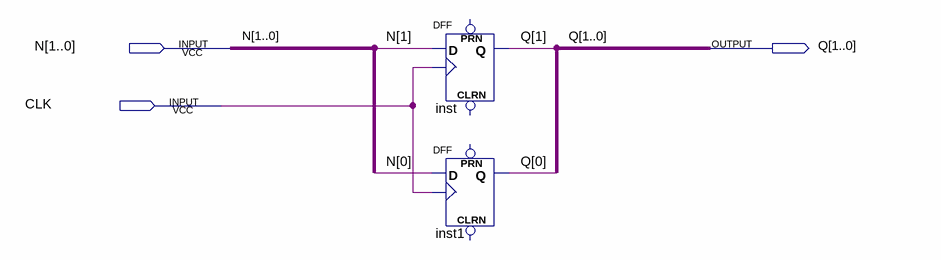
[diagram p0: schematic sheet]
// Quartus schematic DFF2.bdf as structural Verilog: 2 symbols, 3 pins
module DFF2 (
  input  [1:0] N,
  input  CLK,
  output [1:0] Q
);

  DFF inst (.CLK(CLK), .D(N[1]), .Q(Q[1]));  // open: CLRN, PRN
  DFF inst1 (.CLK(CLK), .D(N[0]), .Q(Q[0]));  // open: CLRN, PRN
endmodule
